# Altium project BMS_Master.PrjPcb (part 2 of 2)

## Sheet HV.SchDoc
size A4; SheetNumber: 2; SheetTotal: 10
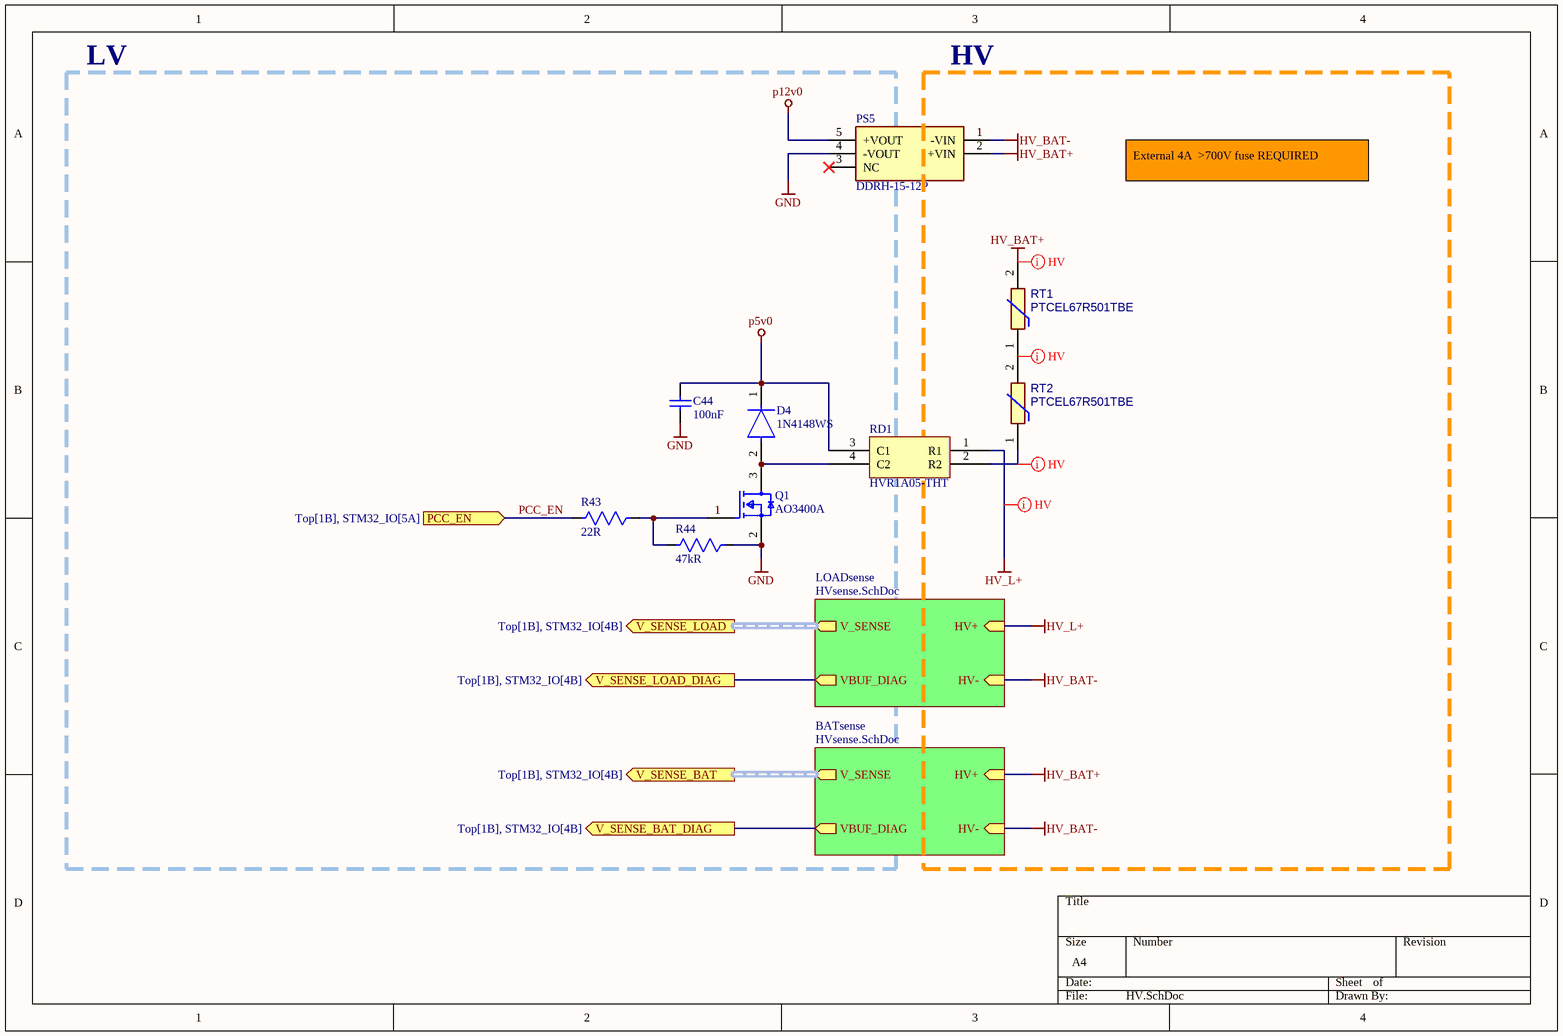
[diagram p9: HV.SchDoc]

### Parts
C44  value 100nF  [WCAP-CSGP_0603_L1.6W0.8H0.8_Reflow]  (hidden comment: CAP 0603 100nF X7R)
D4  1N4148WS  [FP-477AB-IPC_C]
PS5  DDRH-15-12P  [DDRH1512P]
Q1  AO3400A  [FP-SOT23-MFG]
R43  value 22R  [RES_SM0603_YAGEORC_N]  (hidden comment: RES 0603 22R 1%)
R44  value 47kR  [RES_SM0603_YAGEORC_N]  (hidden comment: RES 0603 47kR 1%)
RD1  HVR1A05-THT  [HVR1A05-THT]
RT1  PTCEL67R501TBE  [PTCEL67R501TBE-Footprint-1]
RT2  PTCEL67R501TBE  [PTCEL67R501TBE-Footprint-1]

### Blocks framed on the sheet
LV: C44 D4 Q1 R43 R44
HV: RT1 RT2

### Sub-sheets
BATsense = HVsense.SchDoc: HV+ (in), HV- (in), VBUF_DIAG (out), V_SENSE (out, harness ANA_DIF)
LOADsense = HVsense.SchDoc: HV+ (in), HV- (in), VBUF_DIAG (out), V_SENSE (out, harness ANA_DIF)

### Ports
PCC_EN (in, see Top[1B], STM32_IO[5A]), V_SENSE_BAT (out, see Top[1B], STM32_IO[4B]), V_SENSE_BAT_DIAG (out, see Top[1B], STM32_IO[4B]), V_SENSE_LOAD (out, see Top[1B], STM32_IO[4B]), V_SENSE_LOAD_DIAG (out, see Top[1B], STM32_IO[4B])

### Nets
GND: C44.2 PS5.4(-VOUT) Q1.2(S) R44.1
HV_BAT+: PS5.2(+VIN) RT1.2 ; sheet BATsense/HV+
HV_BAT-: PS5.1(-VIN) ; sheet LOADsense/HV-, sheet BATsense/HV-
HV_L+: RD1.1(R1) ; sheet LOADsense/HV+
p5v0: C44.1 D4.1(C) RD1.3(C1)
p12v0: PS5.5(+VOUT)
PCC_EN: R43.2 ; port PCC_EN
V_SENSE_BAT_DIAG: port V_SENSE_BAT_DIAG, sheet BATsense/VBUF_DIAG
V_SENSE_LOAD_DIAG: port V_SENSE_LOAD_DIAG, sheet LOADsense/VBUF_DIAG
NetD4_2: D4.2(A) Q1.3(D) RD1.4(C2)
NetQ1_1: Q1.1(G) R43.1 R44.2
NetRD1_2: RD1.2(R2) RT2.1
NetRT1_1: RT1.1 RT2.2

Not connected (* = marked no-connect by the designer): PS5 3(NC)*

### Buses and harness runs
harness port V_SENSE_BAT = sheet BATsense/V_SENSE
harness port V_SENSE_LOAD = sheet LOADsense/V_SENSE

### Layout directives
net class HV: HV_BAT+, HV_L+, NetRD1_2, NetRT1_1

### Notes on the sheet
- External 4A  >700V fuse REQUIRED

### Library data of the parts
C44 = CMP-001-01309-1: GTT Standard 0603 non-polarized capacitor; Case/Package: 0603; Category: Multilayer Ceramic Chip Capacitors; Ceramic Type: X7R; Pins: 2; JLCPCB Part #: C14663
D4 = CMP-07163-000040-1: DIODE GEN PURP 75V 150MA SOD323F; Forward Voltage: 1V; Power Dissipation: 200mW; Element Configuration: Single; Max Forward Surge Current (Ifsm): 2A; Peak Reverse Current: 5uA; Recovery Time: 4ns; Package Quantity: 1; Number of Pins: 2; Height: 1mm; REACH SVHC: No SVHC; Max Reverse Voltage (DC): 75V; Forward Current: 150mA; Length: 1.8mm; Max Repetitive Reverse Voltage (Vrrm): 75V; Max Operating Temperature: 150°C; Average Rectified Current: 150mA; Contact Plating: Tin; Packaging: Tape and Reel; Radiation Hardening: No; Min Operating Temperature: -55°C; Width: 1.35mm; Weight: 0.0276g; Lead Free: Lead Free; Mount: Surface Mount; Reverse Voltage: 75V; Reverse Recovery Time: 4ns
PS5 = DDRH-15-12P: Power Supply; Manufacturer_Name: Mean Well; Datasheet Link: https://www.meanwell.com/webapp/product/search.aspx?prod=DDRH-15; Height: 25.03mm; Manufacturer_Part_Number: DDRH-15-12P; Arrow Part Number: DDRH-15-12P; Arrow Price/Stock: https://www.arrow.com/en/products/ddrh-15-12p/mean-well-enterprises?utm_currency=USD&region=nac
Q1 = CMP-83955-000006-1: MOSFET N-CH 30V 5.7A SOT23; Input Capacitance: 630pF; Number of Elements: 1; Rds On Max: 26.5mR; Max Power Dissipation: 1.4W; Gate to Source Voltage (Vgs): 12V; Min Operating Temperature: -55°C; Lead Free: Lead Free; Number of Pins: 3; Drain to Source Voltage (Vdss): 30V; Case/Package: SOT-23; Mount: Surface Mount; Continuous Drain Current (ID): 5.7A; Radiation Hardening: No; Packaging: Tape and Reel; Max Operating Temperature: 150°C; Power Dissipation: 1.4W
R43 R44 = CMP-009-00206-3: GTT Standard 0603 Resistor; Voltage Rating: 50V; Power: 62.5mW; Case/Package: 0603; Tolerance: 1%; Mounting Technology: SMD
  R43: JLCPCB Part #: C23345
  R44: JLCPCB Part #: C25819
RT1 RT2 = CMP-009-00210-4: VISHAY - PTCEL67R501TBE - PTC THERMISTOR; R25 value: 500 Ohms; Value: 500; Voltage Rating: 1.2kV; Pins: 2; RoHS Compliant: yes; Min Operating Temperature: -40°C; Mounting Technology: Through hole mount; Max Operating Temperature: 105°C; ComponentLink1Description: Datasheet; ComponentLink1URL: https://www.vishay.com/docs/29207/ptcel_highenergy-series.pdf; ClassName: HV; JLCPCB Part #: C23949633
RD1 = HVR1A05-THT: ComponentLink1Description: Datasheet; ComponentLink1URL: https://jlcpcb.com/api/file/downloadByFileSystemAccessId/8603384602715443200

## Sheet HVsense.SchDoc
size A3; CompanyName: Hydriven; Organization: Hydriven; Revision: V1.1; SheetNumber: 3; SheetTotal: 10; Team: 2025; Subsystem: Embedded Systems
Used 2 times, as channels Designator/LOADsense, Designator/BATsense. Parts and nets are listed once, with the designators drawn on the sheet.
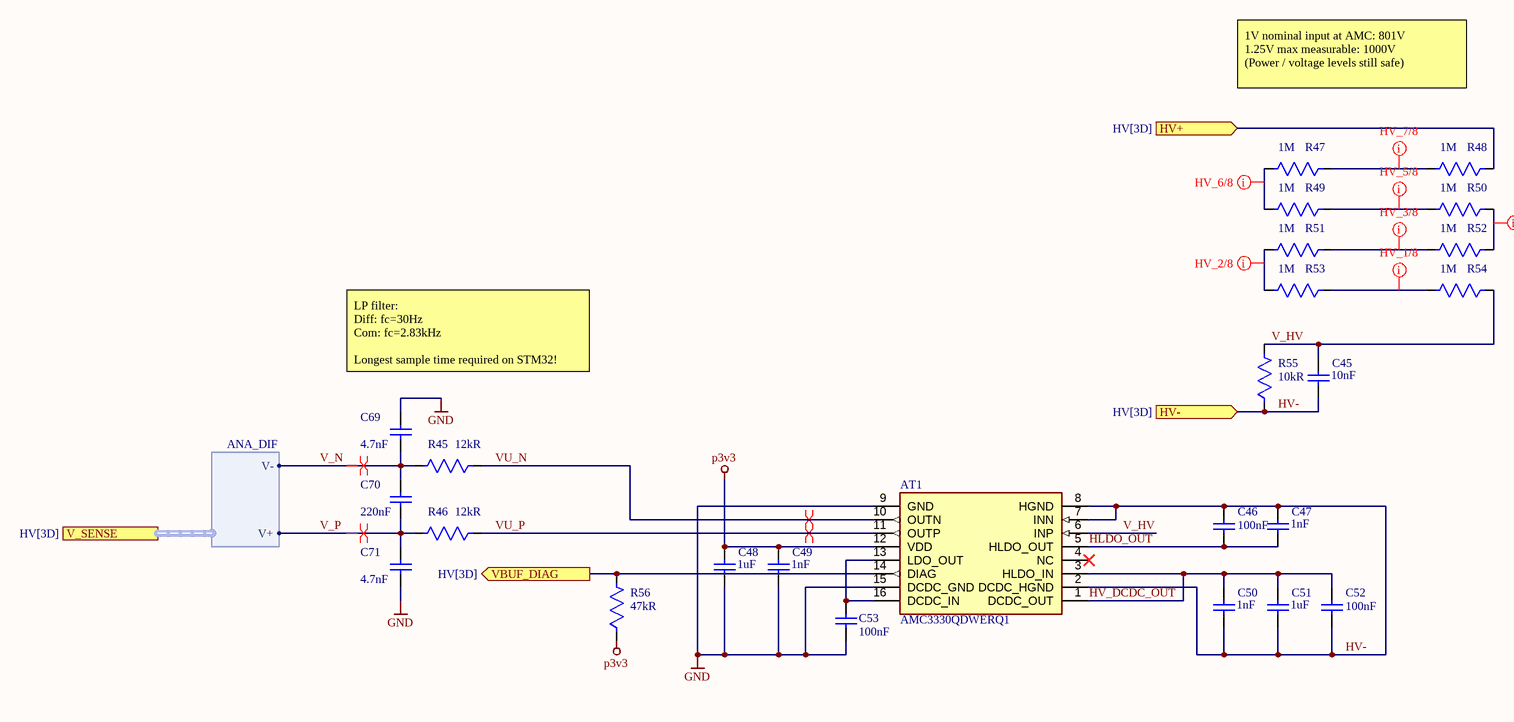
[diagram p10: HVsense.SchDoc]

### Parts
AT1  AMC3330QDWERQ1  [SOIC127P1030X265-16N]
C45  value 10nF  [WCAP-CSGP_0603_L1.6W0.8H0.8_Reflow]  (hidden comment: CAP 0603 10nF X7R)
C46  value 100nF  [WCAP-CSGP_0603_L1.6W0.8H0.8_Reflow]  (hidden comment: CAP 0603 100nF X7R)
C47  value 1nF  [WCAP-CSGP_0603_L1.6W0.8H0.8_Reflow]  (hidden comment: CAP 0603 1nF X7R)
C48  value 1uF  [WCAP-CSGP_0603_L1.6W0.8H0.8_Reflow]  (hidden comment: CAP 0603 1uF X7R)
C49  value 1nF  [WCAP-CSGP_0603_L1.6W0.8H0.8_Reflow]  (hidden comment: CAP 0603 1nF X7R)
C50  value 1nF  [WCAP-CSGP_0603_L1.6W0.8H0.8_Reflow]  (hidden comment: CAP 0603 1nF X7R)
C51  value 1uF  [WCAP-CSGP_0603_L1.6W0.8H0.8_Reflow]  (hidden comment: CAP 0603 1uF X7R)
C52  value 100nF  [WCAP-CSGP_0603_L1.6W0.8H0.8_Reflow]  (hidden comment: CAP 0603 100nF X7R)
C53  value 100nF  [WCAP-CSGP_0603_L1.6W0.8H0.8_Reflow]  (hidden comment: CAP 0603 100nF X7R)
C69  value 4.7nF  [WCAP-CSGP_0402_L1W0.5H0.5]  (hidden comment: CAP 0402 4.7nF X7R)
C70  value 220nF  [WCAP-CSGP_0402_L1W0.5H0.5]  (hidden comment: CAP 0402 220nF X7R)
C71  value 4.7nF  [WCAP-CSGP_0402_L1W0.5H0.5]  (hidden comment: CAP 0402 4.7nF X7R)
R45  value 12kR  [FP0402]  (hidden comment: RES 0402 12kR 1%)
R46  value 12kR  [FP0402]  (hidden comment: RES 0402 12kR 1%)
R47  value 1M  [RES_SM1206_YAGEORC_N]  (hidden comment: RES 1206 1M 1%)
R48  value 1M  [RES_SM1206_YAGEORC_N]  (hidden comment: RES 1206 1M 1%)
R49  value 1M  [RES_SM1206_YAGEORC_N]  (hidden comment: RES 1206 1M 1%)
R50  value 1M  [RES_SM1206_YAGEORC_N]  (hidden comment: RES 1206 1M 1%)
R51  value 1M  [RES_SM1206_YAGEORC_N]  (hidden comment: RES 1206 1M 1%)
R52  value 1M  [RES_SM1206_YAGEORC_N]  (hidden comment: RES 1206 1M 1%)
R53  value 1M  [RES_SM1206_YAGEORC_N]  (hidden comment: RES 1206 1M 1%)
R54  value 1M  [RES_SM1206_YAGEORC_N]  (hidden comment: RES 1206 1M 1%)
R55  value 10kR  [RES_SM0805_YAGEORC_N]  (hidden comment: RES 0805 10kR 1%)
R56  value 47kR  [RES_SM0603_YAGEORC_N]  (hidden comment: RES 0603 47kR 1%)

### Ports
HV+ (in, see HV[3D]), HV- (in, see HV[3D]), V_SENSE (harness ANA_DIF, see HV[3D]), VBUF_DIAG (out, see HV[3D])

### Harnesses
ANA_DIF: V+, V-

### Nets
GND: AT1.9(GND) AT1.15(DCDC_GND) C48.1 C49.1 C53.2 C69.2 C71.1
p3v3: AT1.12(VDD) C48.2 C49.2 R56.1
HLDO_OUT: AT1.5(HLDO_OUT) C46.2 C47.1
HV+: R48.1 ; port HV+
HV-: AT1.2(DCDC_HGND) AT1.7(INN) AT1.8(HGND) C45.1 C46.1 C47.2 C50.1 C51.1 C52.2 R55.1 ; port HV-
HV_DCDC_OUT: AT1.1(DCDC_OUT) AT1.3(HLDO_IN) C50.2 C51.2 C52.1
V_HV: AT1.6(INP) C45.2 R54.1 R55.2
V_N: C69.1 C70.2 R45.2 ; port V_SENSE.V-
V_P: C70.1 C71.2 R46.2 ; port V_SENSE.V+
VBUF_DIAG: AT1.14(DIAG) R56.2 ; port VBUF_DIAG
VU_N: AT1.10(OUTN) R45.1
VU_P: AT1.11(OUTP) R46.1
NetAT1_13: AT1.13(LDO_OUT) AT1.16(DCDC_IN) C53.1
NetR47_1: R47.1 R48.2
NetR47_2: R47.2 R49.2
NetR49_1: R49.1 R50.2
NetR50_1: R50.1 R52.1
NetR51_1: R51.1 R52.2
NetR51_2: R51.2 R53.2
NetR53_1: R53.1 R54.2

Not connected (* = marked no-connect by the designer): AT1 4(NC)*

### Channels
Designator/LOADsense: designators end in _LOADsense; ports HV+=HV_L+ HV-=HV_BAT- VBUF_DIAG=V_SENSE_LOAD_DIAG
Designator/BATsense: designators end in _BATsense; ports HV+=HV_BAT+ HV-=HV_BAT- VBUF_DIAG=V_SENSE_BAT_DIAG

### Layout directives
differential pair: V_N, V_P, VU_N_LOADsense, VU_P_LOADsense
net class HV_6/8: NetR47_LOADsense_2
net class HV_7/8: NetR47_LOADsense_1
net class HV_5/8: NetR49_LOADsense_1
net class HV_3/8: NetR51_LOADsense_1
net class HV_1/8: NetR53_LOADsense_1
net class HV_2/8: NetR51_LOADsense_2
net class HV_4/8: NetR50_LOADsense_1

### Notes on the sheet
- 1V nominal input at AMC: 801V
  1.25V max measurable: 1000V
  (Power / voltage levels still safe)
- LP filter:
  Diff: fc=30Hz
  Com: fc=2.83kHz
  Longest sample time required on STM32!
- Team
- Authors
- Revision
- Title
- Project
- Subsystem
- File
- Sheet
- //

### Library data of the parts
AT1 = AMC3330QDWERQ1: Attenuator or Isolator; Manufacturer_Name: Texas Instruments; Datasheet Link: https://www.ti.com/lit/ds/symlink/amc3330.pdf?ts=1605812770714&ref_url=https%253A%252F%252Fwww.ti.com%252Fsitesearch%252Fdocs%252Funiversalsearch.tsp%253FsearchTerm%253DAMC3330DWE; Height: 2.65mm; Manufacturer_Part_Number: AMC3330QDWERQ1; Mouser Part Number: 595-AMC3330QDWERQ1; Mouser Price/Stock: https://www.mouser.co.uk/ProductDetail/Texas-Instruments/AMC3330QDWERQ1?qs=81r%252BiQLm7BThq9fK1XpIYg%3D%3D; Arrow Part Number: AMC3330QDWERQ1; Arrow Price/Stock: https://www.arrow.com/en/products/amc3330qdwerq1/texas-instruments?utm_currency=USD&region=nac
C45-C53 = CMP-001-01309-1: as C44 on sheet HV; Case/Package: 0603; Category: Multilayer Ceramic Chip Capacitors; Ceramic Type: X7R; Pins: 2
  C45: JLCPCB Part #: C57112
  C46 C52 C53: JLCPCB Part #: C14663
  C47 C49 C50: JLCPCB Part #: C1588
  C48 C51: JLCPCB Part #: C15849
C69-C71 = CMP-001-01308-5: GTT Standard 0402 non-polarized capacitor; Pins: 2; Case/Package: 0402; Category: Multilayer Ceramic Chip Capacitors; Ceramic Type: X7R
  C69 C71: JLCPCB Part #: C1538
  C70: JLCPCB Part #: C16772
R45 R46 = CMP-009-00204-17: GTT Standard 0402 Resistor; Voltage Rating: 50V; Power: 62.5mW; Mounting Technology: SMD; Tolerance: 1%; Case/Package: 0402; Design Item ID: RES 0402; Source: Passives.SchLib; JLCPCB Part #: C25752
R47-R54 = CMP-009-00208-3: GTT Standard 1206 Resistor; Voltage Rating: 50V; Power: 62.5mW; Tolerance: 1%; Case/Package: 1206; Mounting Technology: SMD; JLCPCB Part #: C17927
R55 = CMP-009-00205-3: GTT Standard 0805 Resistor; Power: 62.5mW; Voltage Rating: 50V; Mounting Technology: SMD; Case/Package: 0805; Tolerance: 1%; JLCPCB Part #: C17414
R56 = CMP-009-00206-3: as R43 on sheet HV; Case/Package: 0603; Tolerance: 1%; Mounting Technology: SMD; JLCPCB Part #: C25819

## Sheet ESP32.SchDoc
size A4; CompanyName: Hydriven; Organization: Hydriven; Revision: V1.1; SheetNumber: 10; SheetTotal: 10; Team: 2025; Subsystem: Embedded Systems
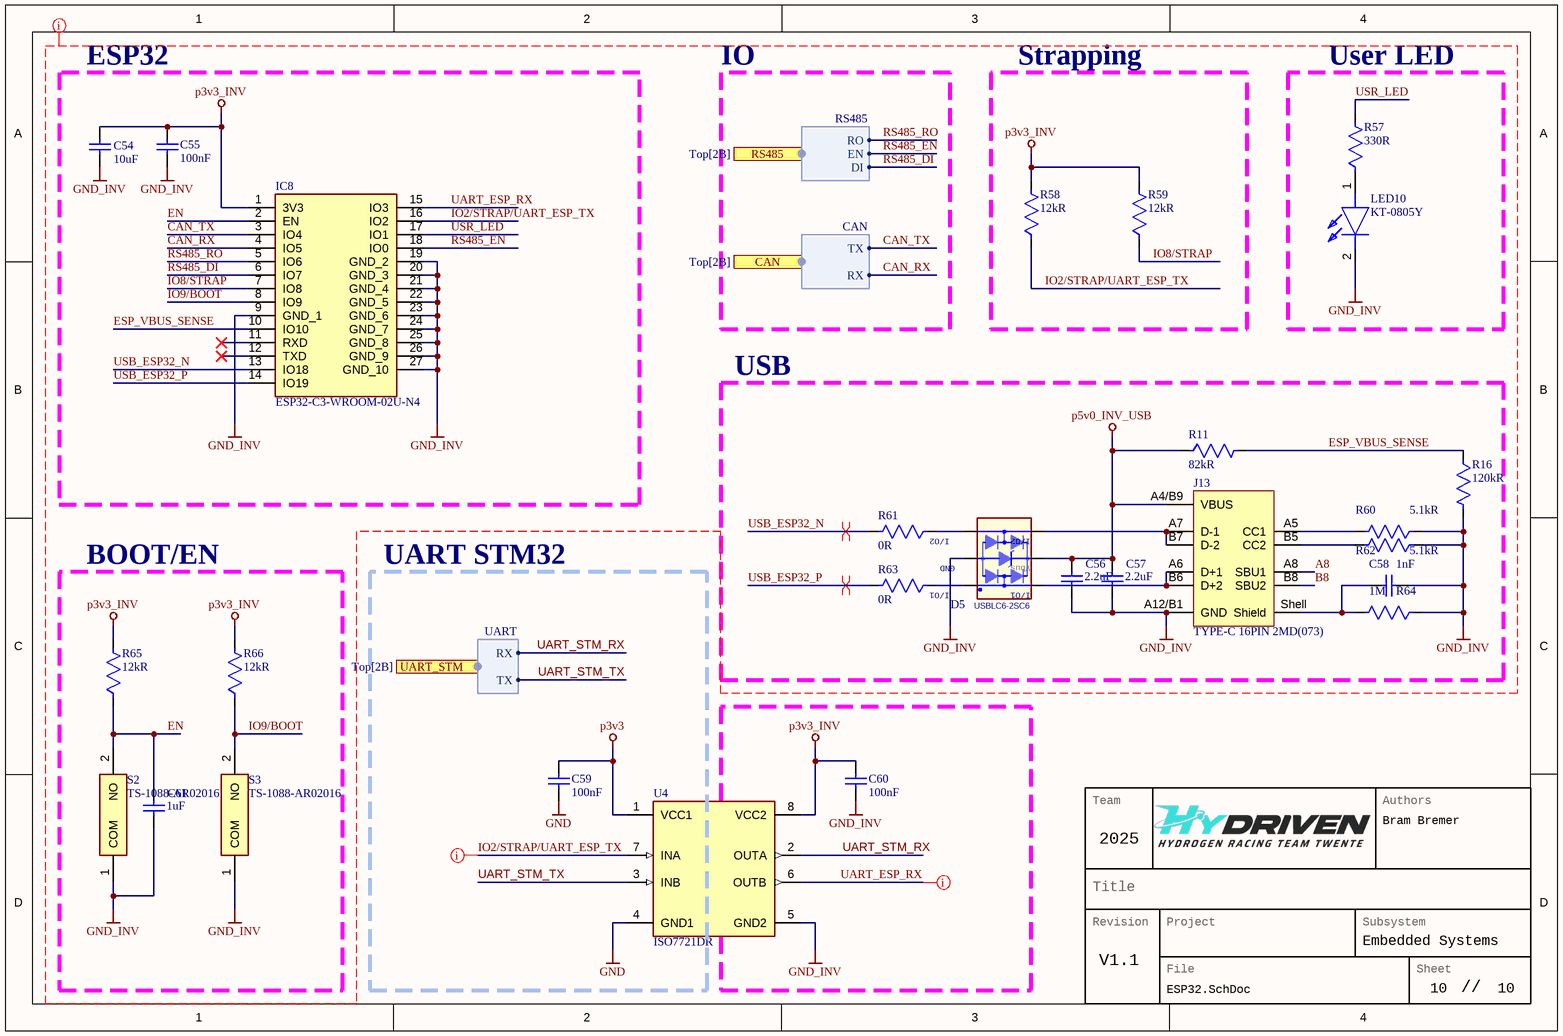
[diagram p11: ESP32.SchDoc]

### Parts
C54  value 10uF  [WCAP-CSGP_1206_L3.2W1.6H1.15]  (hidden comment: CAP 1206 10uF X7R)
C55  value 100nF  [WCAP-CSGP_0402_L1W0.5H0.5]  (hidden comment: CAP 0402 100nF X7R)
C56  value 2.2uF  [WCAP-CSGP_0603_L1.6W0.8H0.8_Reflow]  (hidden comment: CAP 0603 2.2uF X7R)
C57  value 2.2uF  [WCAP-CSGP_0603_L1.6W0.8H0.8_Reflow]  (hidden comment: CAP 0603 2.2uF X7R)
C58  value 1nF  [WCAP-CSGP_1206_L3.2W1.6H1.15]  (hidden comment: CAP 1206 1nF X7R)
C59  value 100nF  [WCAP-CSGP_0402_L1W0.5H0.5]  (hidden comment: CAP 0402 100nF X7R)
C60  value 100nF  [WCAP-CSGP_0402_L1W0.5H0.5]  (hidden comment: CAP 0402 100nF X7R)
C61  value 1uF  [WCAP-CSGP_0402_L1W0.5H0.5]  (hidden comment: CAP 0402 1uF X7R)
D5  USBLC6-2SC6  [ST_SOT23-6L]
IC8  ESP32-C3-WROOM-02U-N4  [ESP32C3WROOM02UN4]
J13  TYPE-C 16PIN 2MD(073)  [629722000214]
LED10  KT-0805Y  [KT0805G]
R11  value 82kR  [RES_SM0603_YAGEORC_N]  (hidden comment: RES 0603 82kR 1%)
R16  value 120kR  [RES_SM0603_YAGEORC_N]  (hidden comment: RES 0603 120kR 1%)
R57  value 330R  [RES_SM0603_YAGEORC_N]  (hidden comment: RES 0603 330R 1%)
R58  value 12kR  [FP0402]  (hidden comment: RES 0402 12kR 1%)
R59  value 12kR  [FP0402]  (hidden comment: RES 0402 12kR 1%)
R60  value 5.1kR  [FP0402]  (hidden comment: RES 0402 5.1kR 1%)
R61  value 0R  [FP0402]  (hidden comment: RES 0402 0R 1%)
R62  value 5.1kR  [FP0402]  (hidden comment: RES 0402 5.1kR 1%)
R63  value 0R  [FP0402]  (hidden comment: RES 0402 0R 1%)
R64  value 1M  [RES_SM1206_YAGEORC_N]  (hidden comment: RES 1206 1M 1%)
R65  value 12kR  [FP0402]  (hidden comment: RES 0402 12kR 1%)
R66  value 12kR  [FP0402]  (hidden comment: RES 0402 12kR 1%)
S2  TS-1088-AR02016  [TS1088AR02016]
S3  TS-1088-AR02016  [TS1088AR02016]
U4  ISO7721DR  [FP-D0008B-MFG]

### Blocks framed on the sheet
ESP32: C54 C55 IC8
Strapping: R58 R59
User LED: LED10 R57
USB: C56-C58 D5 J13 R11 R16 R60-R64
BOOT/EN: C61 R65 R66 S2 S3
UART STM32: C59

### Ports
CAN (out, harness CAN, see Top[2B]), RS485 (out, harness RS485, see Top[2B]), UART_STM (out, harness UART, see Top[2B])

### Harnesses
RS485: RO, EN, DI
CAN: RX, TX
UART: TX, RX

### Nets
GND: C59.1 U4.4(GND1)
GND_INV: C54.1 C55.2 C56.1 C57.1 C58.2 C60.1 C61.1 D5.2(GND) IC8.9(GND_1) IC8.19(GND_2) IC8.20(GND_3) IC8.21(GND_4) IC8.22(GND_5) IC8.23(GND_6) IC8.24(GND_7) IC8.25(GND_8) IC8.26(GND_9) IC8.27(GND_10) J13.A12/B1(GND) LED10.2(K) R16.2 R60.1 R62.1 R64.1 S2.1(COM) S3.1(COM) U4.5(GND2)
p3v3: C59.2 U4.1(VCC1)
p3v3_INV: C54.2 C55.1 C60.2 IC8.1(3V3) R58.2 R59.2 R65.2 R66.2 U4.8(VCC2)
p5v0_INV_USB: C56.2 C57.2 D5.5(Vbus) J13.A4/B9(VBUS) R11.1
A8: J13.A8(SBU1)
B8: J13.B8(SBU2)
CAN_RX: IC8.4(IO5) ; port CAN.RX  [project net CAN_ESP32_RX]
CAN_TX: IC8.3(IO4) ; port CAN.TX  [project net CAN_ESP32_TX]
EN: C61.2 IC8.2(EN) R65.1 S2.2(NO)
ESP_VBUS_SENSE: IC8.10(IO10) R11.2 R16.1
IO2/STRAP/UART_ESP_TX: IC8.16(IO2) R58.1 U4.7(INA)
IO8/STRAP: IC8.7(IO8) R59.1
IO9/BOOT: IC8.8(IO9) R66.1 S3.2(NO)
RS485_DI: IC8.6(IO7) ; port RS485.DI
RS485_EN: IC8.18(IO0) ; port RS485.EN
RS485_RO: IC8.5(IO6) ; port RS485.RO
UART_ESP_RX: IC8.15(IO3) U4.6(OUTB)
UART_STM_RX: U4.2(OUTA) ; port UART_STM.RX  [project net UART_RX_ESP]
UART_STM_TX: U4.3(INB) ; port UART_STM.TX  [project net LED_Y]
USB_ESP32_N: IC8.13(IO18) R61.2
USB_ESP32_P: IC8.14(IO19) R63.2
USR_LED: IC8.17(IO1) R57.2
NetC58_1: C58.1 J13.Shell(Shield) R64.2
NetD5_1: D5.1(I/O1) R63.1
NetD5_3: D5.3(I/O2) R61.1
NetD5_4: D5.4(I/O2+) J13.A7(D-1) J13.B7(D-2)
NetD5_6: D5.6(I/O1+) J13.A6(D+1) J13.B6(D+2)
NetJ13_A5: J13.A5(CC1) R60.2
NetJ13_B5: J13.B5(CC2) R62.2
NetLED10_1: LED10.1(A) R57.1

Not connected (* = marked no-connect by the designer): IC8 11(RXD)* 12(TXD)*

### Layout directives
differential pair; differential pair class USB90; rule Clearance Constraint [Generic clearance = 0.15mm, and 12 value(s) for objects]: USB_ESP32_N, USB_ESP32_P
net class INV: A8, B8, CAN_RX, CAN_TX, EN, ESP_VBUS_SENSE, GND_INV, IO2/STRAP/UART_ESP_TX, IO8/STRAP, IO9/BOOT, p3v3_INV, p5v0_INV_USB, RS485_DI, RS485_EN, RS485_RO, UART_ESP_RX, USB_ESP32_N, USB_ESP32_P, USR_LED

### Notes on the sheet
- IO
- Team
- Authors
- Revision
- Title
- Project
- Subsystem
- File
- Sheet
- //

### Library data of the parts
C54 = CMP-001-01311-1: GTT Standard 1206 non-polarized capacitor; Case/Package: 1206; Ceramic Type: X7R; Category: Multilayer Ceramic Chip Capacitors; Pins: 2; JLCPCB Part #: C13585
C55 C59-C61 = CMP-001-01308-5: as C69 on sheet HVsense; Pins: 2; Case/Package: 0402; Category: Multilayer Ceramic Chip Capacitors; Ceramic Type: X7R
  C55: JLCPCB Part #: C1525
  C59 C60: ClassName: TPL_Trans; JLCPCB Part #: C1525
  C61: JLCPCB Part #: C52923
C56 C57 = CMP-001-01309-1: as C44 on sheet HV; Case/Package: 0603; Category: Multilayer Ceramic Chip Capacitors; Ceramic Type: X7R; Pins: 2; JLCPCB Part #: C23630
C58 = CMP-001-01311-1: GTT Standard 1206 non-polarized capacitor; Voltage Rating: 2kV; Case/Package: 1206; Ceramic Type: X7R; Category: Multilayer Ceramic Chip Capacitors; Pins: 2; JLCPCB Part #: C9196
D5 = CMP-004-00059-1: Design Item ID: USBLC6-2SC6; Source: USBLC6-2SC6.SchLib
IC8 = ESP32-C3-WROOM-02U-N4: Integrated Circuit; Manufacturer_Name: Espressif Systems; Datasheet Link: https://www.espressif.com/sites/default/files/documentation/esp32-c3-wroom-02_datasheet_en.pdf; Height: 3.35mm; Manufacturer_Part_Number: ESP32-C3-WROOM-02U-N4; Mouser Part Number: 356-ESP32C3WROM02UN4; Mouser Price/Stock: https://www.mouser.co.uk/ProductDetail/Espressif-Systems/ESP32-C3-WROOM-02U-N4?qs=pBJMDPsKWf2Ces2aXBSNjQ%3D%3D
J13 = CMP-002-000088-9: WR-USB 2.0 Type C, Receptacle, Horizontal, SMT; pin to pad: A4/B9>A4/B9+A9/B4 A12/B1>A12/B1+A1/B12; Manufacturer: Wurth Elektronik; Number of Ports: 1; Interface Type: Type C; Working Voltage: 20VAC; Rated Current: 5A; ComponentLink1URL: https://www.we-online.com/redexpert/article/629722000214?ad; Number of Pins: 16; ComponentLink2Description: Datasheet Link; Component Type: Standard; Mount: Surface Mount; Manufacturer Part Number: 629722000214; Orientation: Horizontal; Design Item ID: 629722000214; Operating Temperature Max: 85°C; Packaging: Tape and Reel; Operating Temperature Min: -40°C; ComponentLink2URL: https://www.we-online.com/redexpert/spec/629722000214?ad; Pin Count: 13; Source: WR-USB.SchLib; Gender: Receptacle; Application: USB 2.0; Match Code: WR-USB; ComponentLink1Description: Website Link; Category: Input/Output Connectors
LED10 = KT-0805G: LED; Manufacturer_Name: Hubei KENTO Elec; Datasheet Link: https://jlcpcb.com/api/file/downloadByFileSystemAccessId/8639582106239348736; Height: 0.95mm; Manufacturer_Part_Number: KT-0805G; JLCPCB Part #: C2296
R11 R16 R57 = CMP-009-00206-3: as R43 on sheet HV; Case/Package: 0603; Tolerance: 1%; Mounting Technology: SMD
  R11: JLCPCB Part #: C23254
  R16: JLCPCB Part #: C25808
  R57: JLCPCB Part #: C23138
R58-R63 R65 R66 = CMP-009-00204-17: as R45 on sheet HVsense; Case/Package: 0402; Mounting Technology: SMD; Design Item ID: RES 0402; Source: Passives.SchLib; Tolerance: 1%
  R58 R59 R65 R66: JLCPCB Part #: C25752
  R60 R62: JLCPCB Part #: C25905
  R61 R63: JLCPCB Part #: C17168
R64 = CMP-009-00208-3: as R47 on sheet HVsense; Tolerance: 1%; Case/Package: 1206; Mounting Technology: SMD; JLCPCB Part #: C17927
S2 S3 = TS-1088-AR02016: Switch; Manufacturer_Name: XUNPU; Datasheet Link: https://www.xunpudianzi.com/uploads/pdf/TS-1088-ARXXX.pdf; Height: 2mm; Manufacturer_Part_Number: TS-1088-AR02016
U4 = CMP-04872-000019-2: DGTL ISO 3KV GEN PRP 8SOIC; Isolated Power: No; Channel Type: Unidirectional; Pulse Width Distortion (PWD): 4.9ns; Propagation Delay: 16ns; Number of Channels: 2; Data Rate: 100Mbps; Case/Package: SOIC; Number of Pins: 8; Min Operating Temperature: -55°C; Max Operating Temperature: 125°C; Type: General Purpose; Packaging: Tape and Reel; Mount: Surface Mount

## Nets that join several sheets
GND: STM32_IO (17 pins), Power (28 pins), Transceivers (17 pins), Peripherals/ContactorDriver (C62_ContactorDriver.2 C68_ContactorDriver.1 Q2_ContactorDriver.2 R68_ContactorDriver.1), Peripherals/AuxRelay (C62_AuxRelay.2 C68_AuxRelay.1 Q2_AuxRelay.2 R68_AuxRelay.1), Connectors (5 pins), HV (C44.2 PS5.4 Q1.2 R44.1), Designator/LOADsense (7 pins), Designator/BATsense (7 pins), ESP32 (C59.1 U4.4)
GND_INV: Power (17 pins), Transceivers (12 pins), Connectors (J9.2 R37.1 R38.1), ESP32 (27 pins)
HV_BAT+: Connectors (J6.1), HV (PS5.2 RT1.2), Designator/BATsense (R48_BATsense.1)
HV_BAT-: Connectors (J6.3), HV (PS5.1), Designator/LOADsense (10 pins), Designator/BATsense (10 pins)
HV_L+: Connectors (J6.2), HV (RD1.1), Designator/LOADsense (R48_LOADsense.1)
p3v3: Power (11 pins), Transceivers (7 pins), Peripherals (LED7.1 LED8.1 LED9.1), Connectors (J7.1 J11.3), Designator/LOADsense (AT1_LOADsense.12 C48_LOADsense.2 C49_LOADsense.2 R56_LOADsense.1), Designator/BATsense (AT1_BATsense.12 C48_BATsense.2 C49_BATsense.2 R56_BATsense.1), ESP32 (C59.2 U4.1)
p3v3_INV: Power (C23.1 IC4.2 LED3.1 TP5.1), Transceivers (9 pins), Connectors (J9.1), ESP32 (9 pins)
p5v0: Power (5 pins), Transceivers (C32.2 C33.2 IC5.16), HV (C44.1 D4.1 RD1.3)
p5v0_INV_USB: Power (5 pins), ESP32 (5 pins)
p5v0_USB: STM32_IO (5 pins), Power (IC3.6 TP2.1)
p12v0: Power (5 pins), Peripherals (K1.1), Peripherals/ContactorDriver (C62_ContactorDriver.1 C68_ContactorDriver.2 D6_ContactorDriver.1), Peripherals/AuxRelay (C62_AuxRelay.1 C68_AuxRelay.2 D6_AuxRelay.1), Connectors (J4.1 J8.1), HV (PS5.5)
A: Transceivers (IC7.6 R32.2 R33.1), Connectors (R41.1 R42.1)
AUX_IO1: STM32_IO (IC1.44), Connectors (J12.1)
AUX_IO2: STM32_IO (IC1.39), Connectors (J12.2)
AUX_RELAY_EN: STM32_IO (IC1.17), Peripherals/AuxRelay (R67_AuxRelay.2)
B: Transceivers (IC7.7 R31.2 R32.1), Connectors (R39.1 R40.1)
CAN_ESP32_RX: Transceivers (IC9.4), ESP32 (IC8.4)
CAN_ESP32_TX: Transceivers (IC9.1), ESP32 (IC8.3)
CAN_HI: Transceivers (IC6.7 IC9.7 R27.2 R28.2), Connectors (J2.4)
CAN_LO: Transceivers (IC6.6 IC9.6 R29.2 R30.2), Connectors (J2.5)
CAN_RX: STM32_IO (IC1.45), Transceivers (U3.2)
CAN_STM_TX: STM32_IO (IC1.46), Transceivers (U3.3)
CONT_EN: STM32_IO (IC1.14), Peripherals/ContactorDriver (R67_ContactorDriver.2)
CONTACTOR-: Peripherals/ContactorDriver (D6_ContactorDriver.2 Q2_ContactorDriver.3), Connectors (J4.2)
LED_G: STM32_IO (IC1.43), Peripherals (R36.1)
LED_R: STM32_IO (IC1.30), Peripherals (R34.1)
LED_Y: STM32_IO (IC1.31), Peripherals (R35.1), ESP32 (U4.3)
MC_EN: STM32_IO (IC1.28), Transceivers (IC5.4 R26.2)
MC_INT: STM32_IO (IC1.15), Transceivers (IC5.8 R22.1)
MC_RX_MOSI: STM32_IO (IC1.29), Transceivers (IC5.7)
MC_RX_NSS: STM32_IO (IC1.26), Transceivers (IC5.6 R23.1)
MC_RX_SCK: STM32_IO (IC1.27), Transceivers (IC5.5)
MC_TX_MOSI: STM32_IO (IC1.42), Transceivers (IC5.3)
MC_TX_NSS: STM32_IO (IC1.12), Transceivers (IC5.2)
MC_TX_SCK: STM32_IO (IC1.13), Transceivers (IC5.1)
NetD6_AuxRelay_2: Peripherals (K1.5), Peripherals/AuxRelay (D6_AuxRelay.2 Q2_AuxRelay.3)
NRST: STM32_IO (C1.2 IC1.7 S1.1), Connectors (J11.12)
PCC_EN: STM32_IO (IC1.16), HV (R43.2)
RELAY_A: Peripherals (K1.2), Connectors (J5.2)
RELAY_B: Peripherals (K1.3), Connectors (J5.1)
RS485_DI: Transceivers (IC7.4), ESP32 (IC8.6)
RS485_EN: Transceivers (IC7.2 IC7.3), ESP32 (IC8.18)
RS485_RO: Transceivers (IC7.1), ESP32 (IC8.5)
SWCLK: STM32_IO (IC1.38), Connectors (J11.6)
SWDIO: STM32_IO (IC1.37), Connectors (J11.4)
SWO: STM32_IO (IC1.40), Connectors (J11.8)
TPL_N: Transceivers (T1.1), Connectors (J3.5)
TPL_P: Transceivers (T1.3), Connectors (J3.4)
UART_RX_ESP: STM32_IO (IC1.32), ESP32 (U4.2)
V_N: STM32_IO (IC1.9), Designator/LOADsense (C69_LOADsense.1 C70_LOADsense.2 R45_LOADsense.2)
V_N: STM32_IO (IC1.11), Designator/BATsense (C69_BATsense.1 C70_BATsense.2 R45_BATsense.2)
V_P: STM32_IO (IC1.8), Designator/LOADsense (C70_LOADsense.1 C71_LOADsense.2 R46_LOADsense.2)
V_P: STM32_IO (IC1.10), Designator/BATsense (C70_BATsense.1 C71_BATsense.2 R46_BATsense.2)
V_SENSE_BAT_DIAG: STM32_IO (IC1.18), Designator/BATsense (AT1_BATsense.14 R56_BATsense.2)
V_SENSE_LOAD_DIAG: STM32_IO (IC1.2), Designator/LOADsense (AT1_LOADsense.14 R56_LOADsense.2)
VCP_RX: STM32_IO (IC1.25), Connectors (J11.13)
VCP_TX: STM32_IO (IC1.22), Connectors (J11.14)